# Altium schematic sheet [02]-STM32F373BluePill.SchDoc (part 3 of 4)
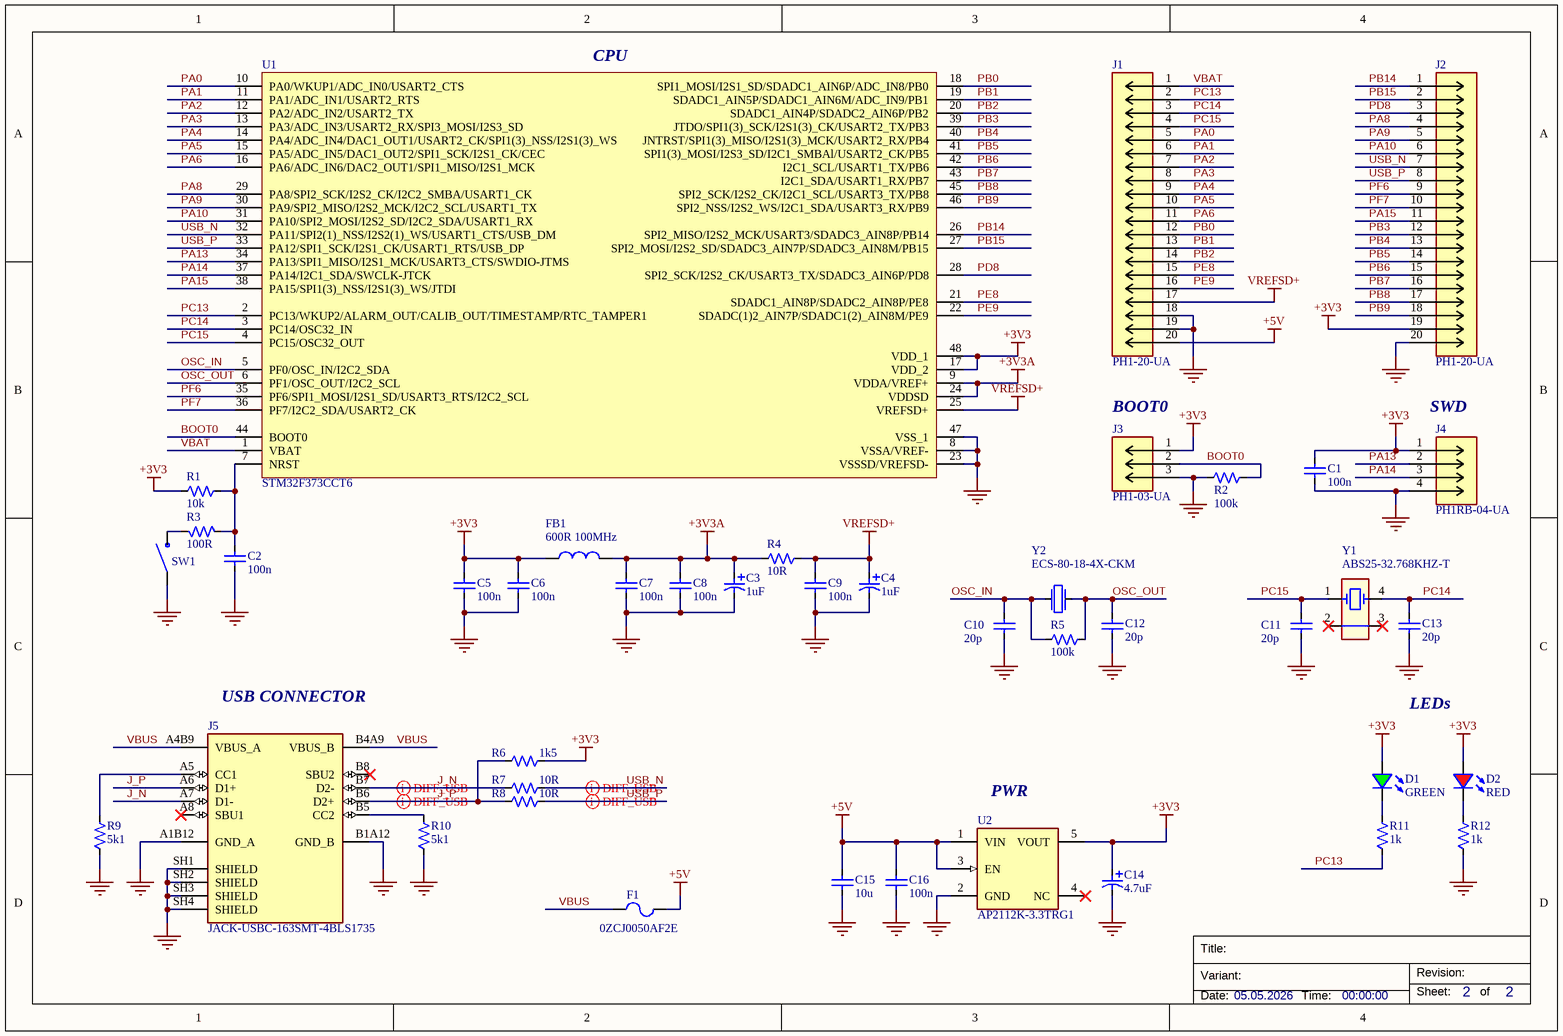
[diagram p2: [02]-STM32F373BluePill.SchDoc]

## Library data of the parts (continued)
R1 = RESC_AC0603FR-0710KL: 10 kOhms ±1% 0.1W, 1/10W Chip Resistor 0603 (1608 Metric) Automotive AEC-Q200, Moisture Resistant Thick Film; Manufacturer 1: Yageo Group; Max Power Dissipation: 100mW; Resistance: 10kΩ; Temperature Coefficient: 100ppm/°C; Voltage Rating: 75V; Tolerance: 1%; Manufacturer Part Number 1: AC0603FR-0710KL; Case/Package: 0603; Supplier 1: DigiKey; Stock 1: 0; Pricing 1: 1=0.1, 10=0.028, 25=0.0204, 50=0.0164, 100=0.0134, 250=0.01036, 500=0.00868, 1000=0.00735 (USD); RoHS: Compliant; Case Code (Imperial): 0603; Case Code (Metric): 1608; China RoHS: Non-Compliant; Composition: Thick Film; Depth: 800µm; Features: Anti-Sulfur, Automotive AEC-Q200, Moisture Resistant; Height: 450µm; Lead Free: Lead Free; Length: 1.6mm; Lifecycle Status: Production; Max Operating Temperature: 155°C; Military Standard: Not; Min Operating Temperature: -55°C; Mount: Surface Mount; Number of Terminals: 2; Number of Terminations: 2; Power Rating: 100mW; Ratings: AEC-Q200; REACH SVHC: Yes; Schedule B: 8533210045, 8533210045|8533210045|8533210045|8533210045|8533210045|8533210045|8533210045|8533210045|8533210045|8533210045|8533210045|8533210045|8533210045|8533210045|8533210045|8533210045|8533210045|8533210045|8533210045|8533210045|8533210045|8533210045|8533210045|85; Termination: SMD/SMT; Width: 800µm; Working Voltage: 75V; ComponentLink1URL: https://datasheet.octopart.com:443/AC0603FR-0710KL-Yageo-datasheet-182189377.pdf?src-supplier=IHS; ComponentLink1Description: https://datasheet.octopart.com:443/AC0603FR-0710KL-Yageo-datasheet-182189377.pdf?src-supplier=IHS; ComponentLink2URL: https://datasheet.octopart.com:443/AC0603FR-0710KL-Yageo-datasheet-86786639.pdf?src-supplier=Upverter; ComponentLink2Description: https://datasheet.octopart.com:443/AC0603FR-0710KL-Yageo-datasheet-86786639.pdf?src-supplier=Upverter; ComponentLink3URL: https://datasheet.octopart.com:443/AC0603FR-0710KL-Yageo-datasheet-178509465.pdf?src-supplier=Newark; ComponentLink3Description: https://datasheet.octopart.com:443/AC0603FR-0710KL-Yageo-datasheet-178509465.pdf?src-supplier=Newark; ComponentLink4URL: https://datasheet.octopart.com:443/AC0603FR-0710KL-Yageo-datasheet-151884373.pdf?src-supplier=Future+Electronics; ComponentLink4Description: https://datasheet.octopart.com:443/AC0603FR-0710KL-Yageo-datasheet-151884373.pdf?src-supplier=Future+Electronics; ComponentLink5URL: https://datasheet.octopart.com:443/AC0603FR-0710KL-Yageo-Group-datasheet-189830439.pdf?src-supplier=Future+Electronics; ComponentLink5Description: https://datasheet.octopart.com:443/AC0603FR-0710KL-Yageo-Group-datasheet-189830439.pdf?src-supplier=Future+Electronics; ComponentLink6URL: https://datasheet.octopart.com:443/AC0603FR-0710KL-Yageo-datasheet-166720450.pdf?src-supplier=Future+Electronics; ComponentLink6Description: https://datasheet.octopart.com:443/AC0603FR-0710KL-Yageo-datasheet-166720450.pdf?src-supplier=Future+Electronics; ComponentLink7URL: https://datasheet.octopart.com:443/AC0603FR-0710KL-Yageo-datasheet-137699919.pdf?src-supplier=Future+Electronics; ComponentLink7Description: https://datasheet.octopart.com:443/AC0603FR-0710KL-Yageo-datasheet-137699919.pdf?src-supplier=Future+Electronics; ComponentLink8URL: https://datasheet.octopart.com:443/AC0603FR-0710KL-Yageo-datasheet-24580492.pdf?src-supplier=Future+Electronics; ComponentLink8Description: https://datasheet.octopart.com:443/AC0603FR-0710KL-Yageo-datasheet-24580492.pdf?src-supplier=Future+Electronics; ComponentLink9URL: https://datasheet.octopart.com:443/AC0603FR-0710KL-Yageo-datasheet-13029202.pdf?src-supplier=Future+Electronics; ComponentLink9Description: https://datasheet.octopart.com:443/AC0603FR-0710KL-Yageo-datasheet-13029202.pdf?src-supplier=Future+Electronics; ComponentLink10URL: https://datasheet.octopart.com/AC0603FR-0710KL-Yageo-datasheet-12512238.pdf; ComponentLink10Description: https://datasheet.octopart.com/AC0603FR-0710KL-Yageo-datasheet-12512238.pdf; ComponentLink11URL: https://datasheet.octopart.com:443/AC0603FR-0710KL-Yageo-Group-datasheet-164768995.pdf?src-supplier=ODG+(Origin+Data+Global); ComponentLink11Description: https://datasheet.octopart.com:443/AC0603FR-0710KL-Yageo-Group-datasheet-164768995.pdf?src-supplier=ODG+(Origin+Data+Global); ComponentLink12URL: http://sigma.octopart.com:80/conflict_mineral_statement/Yageo-company-3.pdf?src-supplier=Compliance+Statements; ComponentLink12Description: http://sigma.octopart.com:80/conflict_mineral_statement/Yageo-company-3.pdf?src-supplier=Compliance+Statements; ComponentLink13URL: http://sigma.octopart.com:80/rohs_statement/Yageo-company-2.pdf?src-supplier=Compliance+Statements; ComponentLink13Description: http://sigma.octopart.com:80/rohs_statement/Yageo-company-2.pdf?src-supplier=Compliance+Statements; Supplier Part Number 1: 311-10KLDCT-ND
R2 R5 = RESC_RC0603DR-07100KL: 100 kOhms ±0.5% 0.1W, 1/10W Chip Resistor 0603 (1608 Metric) Moisture Resistant Thick Film; Manufacturer 1: Yageo Group; Max Power Dissipation: 100mW; Resistance: 100kΩ; Temperature Coefficient: 100ppm/°C; Working Voltage: 75V; Tolerance: 0.5%; Supplier 1: DigiKey; Manufacturer Part Number 1: RC0603DR-07100KL; Stock 1: 43341; Pricing 1: 1=0.1, 10=0.043, 25=0.032, 50=0.0264, 100=0.0219, 250=0.0174, 500=0.01486, 1000=0.01285 (USD); RoHS: Compliant; Case/Package: 0603; China RoHS: Non-Compliant; Composition: Thick Film; Country of Origin: Mainland China, Taiwan; Export Control Classification Number (ECCN) Code: EAR99; Features: Moisture Resistant; Height: 450µm; Harmonized Tariff Schedule (HTS) Code: 8533.21.00.30; Introduction Date: 2012-06-29; Length: 1.6mm; Lifecycle Status: Production; Max Operating Temperature: 155°C; Min Operating Temperature: -55°C; Mount: Surface Mount; Number of Terminals: 2; Number of Terminations: 2; Power Rating: 100mW; REACH SVHC: Yes; Schedule B: 8533210045, 8533210045|8533210045|8533210045|8533210045|8533210045; Width: 800µm; ComponentLink1URL: https://datasheet.octopart.com:443/RC0603DR-07100KL-Yageo-datasheet-175887523.pdf?src-supplier=Newark; ComponentLink1Description: https://datasheet.octopart.com:443/RC0603DR-07100KL-Yageo-datasheet-175887523.pdf?src-supplier=Newark; ComponentLink2URL: https://datasheet.octopart.com:443/RC0603DR-07100KL-Yageo-Group-datasheet-176638170.pdf?src-supplier=Future+Electronics; ComponentLink2Description: https://datasheet.octopart.com:443/RC0603DR-07100KL-Yageo-Group-datasheet-176638170.pdf?src-supplier=Future+Electronics; ComponentLink3URL: https://datasheet.octopart.com:443/RC0603DR-07100KL-Yageo-datasheet-164759695.pdf?src-supplier=Future+Electronics; ComponentLink3Description: https://datasheet.octopart.com:443/RC0603DR-07100KL-Yageo-datasheet-164759695.pdf?src-supplier=Future+Electronics; ComponentLink4URL: https://datasheet.octopart.com:443/RC0603DR-07100KL-Yageo-datasheet-127823281.pdf?src-supplier=Future+Electronics; ComponentLink4Description: https://datasheet.octopart.com:443/RC0603DR-07100KL-Yageo-datasheet-127823281.pdf?src-supplier=Future+Electronics; ComponentLink5URL: https://datasheet.octopart.com:443/RC0603DR-07100KL-Yageo-datasheet-137700087.pdf?src-supplier=Future+Electronics; ComponentLink5Description: https://datasheet.octopart.com:443/RC0603DR-07100KL-Yageo-datasheet-137700087.pdf?src-supplier=Future+Electronics; ComponentLink6URL: https://datasheet.octopart.com:443/RC0603DR-07100KL-Yageo-datasheet-103092701.pdf?src-supplier=Future+Electronics; ComponentLink6Description: https://datasheet.octopart.com:443/RC0603DR-07100KL-Yageo-datasheet-103092701.pdf?src-supplier=Future+Electronics; ComponentLink7URL: https://datasheet.octopart.com/RC0603DR-07100KL-Yageo-datasheet-73766026.pdf; ComponentLink7Description: https://datasheet.octopart.com/RC0603DR-07100KL-Yageo-datasheet-73766026.pdf; ComponentLink8URL: http://sigma.octopart.com:80/conflict_mineral_statement/Yageo-company-3.pdf?src-supplier=Compliance+Statements; ComponentLink8Description: http://sigma.octopart.com:80/conflict_mineral_statement/Yageo-company-3.pdf?src-supplier=Compliance+Statements; ComponentLink9URL: http://sigma.octopart.com:80/rohs_statement/Yageo-company-2.pdf?src-supplier=Compliance+Statements; ComponentLink9Description: http://sigma.octopart.com:80/rohs_statement/Yageo-company-2.pdf?src-supplier=Compliance+Statements; Supplier Part Number 1: 13-RC0603DR-07100KLDKR-ND
R3 = RESC_RC0603FR-10100RL: 100 Ohms ±1% 0.1W, 1/10W Chip Resistor 0603 (1608 Metric) Moisture Resistant Thick Film; Manufacturer 1: Yageo Group; Power Rating: 100mW; Resistance: 100Ω; Temperature Coefficient: 100ppm/°C; Voltage Rating: 50V; Working Voltage: 75V; Supplier 1: DigiKey; Manufacturer Part Number 1: RC0603FR-10100RL; Stock 1: 209381; Pricing 1: 1=0.1, 10=0.024, 25=0.0172, 50=0.0138, 100=0.0112, 250=0.0086, 500=0.00716, 1000=0.00603, 5000=0.00424 (USD); RoHS: Compliant; Case/Package: 0603; Case Code (Imperial): 0603; Case Code (Metric): 1608; China RoHS: Non-Compliant; Composition: Thick Film; Contact Plating: Lead, Tin; Depth: 800µm; Height: 450µm; Lead Free: Lead Free; Length: 1.6mm; Lifecycle Status: Production; Max Operating Temperature: 155°C; Military Standard: Not; Min Operating Temperature: -55°C; Mount: Surface Mount; Number of Pins: 2; Number of Terminals: 2; Radiation Hardening: No; REACH SVHC: Yes; Schedule B: 8533210045, 8533210045|8533210045, 8533210045|8533210045|8533210045, 8533210045|8533210045|8533210045|8533210045; Termination: SMD/SMT; Tolerance: 1%; Voltage Rating (DC): 50V; Width: 800µm; ComponentLink1URL: https://datasheet.octopart.com:443/RC0603FR-10100RL-Yageo-datasheet-175887523.pdf?src-supplier=IHS; ComponentLink1Description: https://datasheet.octopart.com:443/RC0603FR-10100RL-Yageo-datasheet-175887523.pdf?src-supplier=IHS; ComponentLink2URL: https://datasheet.octopart.com:443/RC0603FR-10100RL-Yageo-Group-datasheet-190305687.pdf?src-supplier=Future+Electronics; ComponentLink2Description: https://datasheet.octopart.com:443/RC0603FR-10100RL-Yageo-Group-datasheet-190305687.pdf?src-supplier=Future+Electronics; ComponentLink3URL: https://datasheet.octopart.com:443/RC0603FR-10100RL-Yageo-datasheet-164759695.pdf?src-supplier=Future+Electronics; ComponentLink3Description: https://datasheet.octopart.com:443/RC0603FR-10100RL-Yageo-datasheet-164759695.pdf?src-supplier=Future+Electronics; ComponentLink4URL: https://datasheet.octopart.com:443/RC0603FR-10100RL-Yageo-datasheet-137700087.pdf?src-supplier=Future+Electronics; ComponentLink4Description: https://datasheet.octopart.com:443/RC0603FR-10100RL-Yageo-datasheet-137700087.pdf?src-supplier=Future+Electronics; ComponentLink5URL: https://datasheet.octopart.com:443/RC0603FR-10100RL-Yageo-datasheet-27584510.pdf?src-supplier=Future+Electronics; ComponentLink5Description: https://datasheet.octopart.com:443/RC0603FR-10100RL-Yageo-datasheet-27584510.pdf?src-supplier=Future+Electronics; ComponentLink6URL: https://datasheet.octopart.com:443/RC0603FR-10100RL-Yageo-datasheet-17842380.pdf?src-supplier=Future+Electronics; ComponentLink6Description: https://datasheet.octopart.com:443/RC0603FR-10100RL-Yageo-datasheet-17842380.pdf?src-supplier=Future+Electronics; ComponentLink7URL: https://datasheet.octopart.com:443/RC0603FR-10100RL-Yageo-datasheet-12596169.pdf?src-supplier=Future+Electronics; ComponentLink7Description: https://datasheet.octopart.com:443/RC0603FR-10100RL-Yageo-datasheet-12596169.pdf?src-supplier=Future+Electronics; ComponentLink8URL: https://datasheet.octopart.com:443/RC0603FR-10100RL-Yageo-Group-datasheet-190051977.pdf?src-supplier=Newark; ComponentLink8Description: https://datasheet.octopart.com:443/RC0603FR-10100RL-Yageo-Group-datasheet-190051977.pdf?src-supplier=Newark; ComponentLink9URL: https://datasheet.octopart.com:443/RC0603FR-10100RL-Yageo-Group-datasheet-189192902.pdf?src-supplier=TME; ComponentLink9Description: https://datasheet.octopart.com:443/RC0603FR-10100RL-Yageo-Group-datasheet-189192902.pdf?src-supplier=TME; ComponentLink10URL: https://datasheet.octopart.com:443/RC0603FR-10100RL-Yageo-Group-datasheet-176638170.pdf?src-supplier=TME; ComponentLink10Description: https://datasheet.octopart.com:443/RC0603FR-10100RL-Yageo-Group-datasheet-176638170.pdf?src-supplier=TME; ComponentLink11URL: https://datasheet.octopart.com:443/RC0603FR-10100RL-Yageo-datasheet-8328172.pdf?src-supplier=element14+APAC; ComponentLink11Description: https://datasheet.octopart.com:443/RC0603FR-10100RL-Yageo-datasheet-8328172.pdf?src-supplier=element14+APAC; ComponentLink12URL: https://datasheet.octopart.com:443/RC0603FR-10100RL-Yageo-datasheet-34211833.pdf?src-supplier=element14+APAC; ComponentLink12Description: https://datasheet.octopart.com:443/RC0603FR-10100RL-Yageo-datasheet-34211833.pdf?src-supplier=element14+APAC; ComponentLink13URL: https://datasheet.octopart.com/RC0603FR-10100RL-Yageo-datasheet-73766026.pdf; ComponentLink13Description: https://datasheet.octopart.com/RC0603FR-10100RL-Yageo-datasheet-73766026.pdf; ComponentLink14URL: http://sigma.octopart.com:80/conflict_mineral_statement/Yageo-company-3.pdf?src-supplier=Compliance+Statements; ComponentLink14Description: http://sigma.octopart.com:80/conflict_mineral_statement/Yageo-company-3.pdf?src-supplier=Compliance+Statements; Supplier Part Number 1: 13-RC0603FR-10100RLCT-ND; ComponentLink15URL: http://sigma.octopart.com:80/rohs_statement/Yageo-company-2.pdf?src-supplier=Compliance+Statements; ComponentLink15Description: http://sigma.octopart.com:80/rohs_statement/Yageo-company-2.pdf?src-supplier=Compliance+Statements
R4 R7 R8 = RESC_RC0603FR-0710RL: Res Thick Film 0603 10 Ohm 1% 0.1W(1/10W) ±200ppm/C Pad SMD T/R; Manufacturer 1: Yageo Group; Power Dissipation: 100mW; Resistance: 10Ω; Temperature Coefficient: 200ppm/°C; Voltage Rating: 50V; Working Voltage: 75V; Supplier 1: DigiKey; Manufacturer Part Number 1: RC0603FR-0710RL; Stock 1: 1408775; Pricing 1: 1=0,14, 10=0,013, 25=0,0124, 50=0,0112, 100=0,0092 (USD); RoHS: Compliant; Case/Package: 0603; Case Code (Imperial): 0603; Case Code (Metric): 0603; China RoHS: Non-Compliant; Composition: Thick Film; Contact Plating: Tin; Depth: 800µm; Height: 450µm; Lead Free: Lead Free; Length: 1.6mm; Lifecycle Status: Production; Max Operating Temperature: 155°C; Military Standard: Not; Min Operating Temperature: -55°C; Mount: Surface Mount; Number of Pins: 2; Number of Terminals: 2; Packaging: Tape and Reel; Power Rating: 100mW; Radiation Hardening: No; REACH SVHC: Yes; Schedule B: 8533210045, 8533210045|8533210045|8533210045|8533210045|8533210045|8533210045|8533210045|8533210045|8533210045|8533210045|8533210045|8533210045|8533210045|8533210045|8533210045|8533210045|8533210045|8533210045|8533210045|8533210045|8533210045|8533210045|8533210045|85; Termination: SMD/SMT; Tolerance: 1%; Voltage Rating (AC): 50V; Voltage Rating (DC): 50V; Width: 800µm; ComponentLink1URL: https://datasheet.octopart.com:443/RC0603FR-0710RL-Yageo-datasheet-175887523.pdf?src-supplier=IHS; ComponentLink1Description: https://datasheet.octopart.com:443/RC0603FR-0710RL-Yageo-datasheet-175887523.pdf?src-supplier=IHS; ComponentLink2URL: https://datasheet.octopart.com:443/RC0603FR-0710RL-Yageo-datasheet-62067350.pdf?src-supplier=Farnell; ComponentLink2Description: https://datasheet.octopart.com:443/RC0603FR-0710RL-Yageo-datasheet-62067350.pdf?src-supplier=Farnell; ComponentLink3URL: https://datasheet.octopart.com:443/RC0603FR-0710RL-Yageo-Group-datasheet-176638170.pdf?src-supplier=Farnell; ComponentLink3Description: https://datasheet.octopart.com:443/RC0603FR-0710RL-Yageo-Group-datasheet-176638170.pdf?src-supplier=Farnell; ComponentLink4URL: https://datasheet.octopart.com:443/RC0603FR-0710RL-Yageo-datasheet-13691069.pdf?src-supplier=Farnell; ComponentLink4Description: https://datasheet.octopart.com:443/RC0603FR-0710RL-Yageo-datasheet-13691069.pdf?src-supplier=Farnell; ComponentLink5URL: https://datasheet.octopart.com:443/RC0603FR-0710RL-Yageo-datasheet-103092701.pdf?src-supplier=Upverter; ComponentLink5Description: https://datasheet.octopart.com:443/RC0603FR-0710RL-Yageo-datasheet-103092701.pdf?src-supplier=Upverter; ComponentLink6URL: https://datasheet.octopart.com:443/RC0603FR-0710RL-Yageo-datasheet-98239111.pdf?src-supplier=Upverter; ComponentLink6Description: https://datasheet.octopart.com:443/RC0603FR-0710RL-Yageo-datasheet-98239111.pdf?src-supplier=Upverter; ComponentLink7URL: https://datasheet.octopart.com:443/RC0603FR-0710RL-Yageo-datasheet-79472498.pdf?src-supplier=Upverter; ComponentLink7Description: https://datasheet.octopart.com:443/RC0603FR-0710RL-Yageo-datasheet-79472498.pdf?src-supplier=Upverter; ComponentLink8URL: https://datasheet.octopart.com:443/RC0603FR-0710RL-Yageo-datasheet-8328172.pdf?src-supplier=element14+APAC; ComponentLink8Description: https://datasheet.octopart.com:443/RC0603FR-0710RL-Yageo-datasheet-8328172.pdf?src-supplier=element14+APAC; ComponentLink9URL: https://datasheet.octopart.com:443/RC0603FR-0710RL-Yageo-datasheet-164759695.pdf?src-supplier=Future+Electronics; ComponentLink9Description: https://datasheet.octopart.com:443/RC0603FR-0710RL-Yageo-datasheet-164759695.pdf?src-supplier=Future+Electronics; ComponentLink10URL: https://datasheet.octopart.com:443/RC0603FR-0710RL-Yageo-datasheet-137700087.pdf?src-supplier=Future+Electronics; ComponentLink10Description: https://datasheet.octopart.com:443/RC0603FR-0710RL-Yageo-datasheet-137700087.pdf?src-supplier=Future+Electronics; ComponentLink11URL: https://datasheet.octopart.com:443/RC0603FR-0710RL-Yageo-datasheet-27584510.pdf?src-supplier=Future+Electronics; ComponentLink11Description: https://datasheet.octopart.com:443/RC0603FR-0710RL-Yageo-datasheet-27584510.pdf?src-supplier=Future+Electronics; ComponentLink12URL: https://datasheet.octopart.com:443/RC0603FR-0710RL-Yageo-datasheet-15599030.pdf?src-supplier=Future+Electronics; ComponentLink12Description: https://datasheet.octopart.com:443/RC0603FR-0710RL-Yageo-datasheet-15599030.pdf?src-supplier=Future+Electronics; ComponentLink13URL: https://datasheet.octopart.com:443/RC0603FR-0710RL-Yageo-datasheet-12596169.pdf?src-supplier=Future+Electronics; ComponentLink13Description: https://datasheet.octopart.com:443/RC0603FR-0710RL-Yageo-datasheet-12596169.pdf?src-supplier=Future+Electronics; ComponentLink14URL: https://datasheet.octopart.com:443/RC0603FR-0710RL-Yageo-datasheet-8324193.pdf?src-supplier=Future+Electronics; ComponentLink14Description: https://datasheet.octopart.com:443/RC0603FR-0710RL-Yageo-datasheet-8324193.pdf?src-supplier=Future+Electronics; ComponentLink15URL: https://datasheet.octopart.com:443/RC0603FR-0710RL-Yageo-datasheet-34211833.pdf?src-supplier=Newark; ComponentLink15Description: https://datasheet.octopart.com:443/RC0603FR-0710RL-Yageo-datasheet-34211833.pdf?src-supplier=Newark; ComponentLink16URL: https://datasheet.octopart.com/RC0603FR-0710RL-Yageo-datasheet-73766026.pdf; ComponentLink16Description: https://datasheet.octopart.com/RC0603FR-0710RL-Yageo-datasheet-73766026.pdf; ComponentLink17URL: https://datasheet.octopart.com:443/RC0603FR-0710RL-Yageo-datasheet-30459151.pdf?src-supplier=Seeed+Studio; ComponentLink17Description: https://datasheet.octopart.com:443/RC0603FR-0710RL-Yageo-datasheet-30459151.pdf?src-supplier=Seeed+Studio; ComponentLink18URL: https://datasheet.octopart.com:443/RC0603FR-0710RL-Yageo-datasheet-14181472.pdf?src-supplier=iiiC; ComponentLink18Description: https://datasheet.octopart.com:443/RC0603FR-0710RL-Yageo-datasheet-14181472.pdf?src-supplier=iiiC; ComponentLink19URL: https://datasheet.octopart.com:443/RC0603FR-0710RL-Yageo-datasheet-118562.pdf?src-supplier=DigiKey; ComponentLink19Description: https://datasheet.octopart.com:443/RC0603FR-0710RL-Yageo-datasheet-118562.pdf?src-supplier=DigiKey; ComponentLink20URL: http://sigma.octopart.com:80/conflict_mineral_statement/Yageo-company-3.pdf?src-supplier=Compliance+Statements; ComponentLink20Description: http://sigma.octopart.com:80/conflict_mineral_statement/Yageo-company-3.pdf?src-supplier=Compliance+Statements; ComponentLink21URL: http://sigma.octopart.com:80/rohs_statement/Yageo-company-2.pdf?src-supplier=Compliance+Statements; ComponentLink21Description: http://sigma.octopart.com:80/rohs_statement/Yageo-company-2.pdf?src-supplier=Compliance+Statements; Supplier Part Number 1: 311-10.0HRCT-ND
R6 = RESC_AC0603FR-071K5L: 1.5 kOhms ±1% 0.1W, 1/10W Chip Resistor 0603 (1608 Metric) Automotive AEC-Q200, Moisture Resistant Thick Film; Manufacturer 1: Yageo Group; Max Power Dissipation: 100mW; Resistance: 1.5kΩ; Temperature Coefficient: 100ppm/°C; Voltage Rating: 75V; Supplier 1: DigiKey; Manufacturer Part Number 1: AC0603FR-071K5L; Stock 1: 23378; Pricing 1: 1=0,1, 10=0,009, 25=0,008, 50=0,0072, 100=0,0069 (USD); RoHS: Compliant; Case/Package: 0603; Case Code (Imperial): 0603; Case Code (Metric): 1608; China RoHS: Non-Compliant; Composition: Thick Film; Features: Anti-Sulfur, Automotive AEC-Q200, Moisture Resistant; Height: 450µm; Lead Free: Lead Free; Length: 1.6002mm; Lifecycle Status: Production; Max Operating Temperature: 155°C; Min Operating Temperature: -55°C; Mount: Surface Mount; Number of Terminals: 2; Number of Terminations: 2; Packaging: Tape & Reel; Power Dissipation: 100mW; Power Rating: 100mW; REACH SVHC: Yes; Schedule B: 8533210045, 8533210045|8533210045, 8533210045|8533210045|8533210045, 8533210045|8533210045|8533210045|8533210045; Termination: SMD/SMT; Tolerance: 1%; Width: 800µm; Working Voltage: 75V; ComponentLink1URL: https://datasheet.octopart.com:443/AC0603FR-071K5L-Yageo-datasheet-182189377.pdf?src-supplier=IHS; ComponentLink1Description: https://datasheet.octopart.com:443/AC0603FR-071K5L-Yageo-datasheet-182189377.pdf?src-supplier=IHS; ComponentLink2URL: https://datasheet.octopart.com:443/AC0603FR-071K5L-Yageo-datasheet-86786639.pdf?src-supplier=Upverter; ComponentLink2Description: https://datasheet.octopart.com:443/AC0603FR-071K5L-Yageo-datasheet-86786639.pdf?src-supplier=Upverter; ComponentLink3URL: https://datasheet.octopart.com:443/AC0603FR-071K5L-Yageo-datasheet-178509465.pdf?src-supplier=Newark; ComponentLink3Description: https://datasheet.octopart.com:443/AC0603FR-071K5L-Yageo-datasheet-178509465.pdf?src-supplier=Newark; ComponentLink4URL: https://datasheet.octopart.com:443/AC0603FR-071K5L-Yageo-Group-datasheet-188689268.pdf?src-supplier=TME; ComponentLink4Description: https://datasheet.octopart.com:443/AC0603FR-071K5L-Yageo-Group-datasheet-188689268.pdf?src-supplier=TME; ComponentLink5URL: https://datasheet.octopart.com:443/AC0603FR-071K5L-Yageo-datasheet-166720450.pdf?src-supplier=Future+Electronics; ComponentLink5Description: https://datasheet.octopart.com:443/AC0603FR-071K5L-Yageo-datasheet-166720450.pdf?src-supplier=Future+Electronics; ComponentLink6URL: https://datasheet.octopart.com:443/AC0603FR-071K5L-Yageo-datasheet-151884373.pdf?src-supplier=Future+Electronics; ComponentLink6Description: https://datasheet.octopart.com:443/AC0603FR-071K5L-Yageo-datasheet-151884373.pdf?src-supplier=Future+Electronics; ComponentLink7URL: https://datasheet.octopart.com:443/AC0603FR-071K5L-Yageo-datasheet-137699919.pdf?src-supplier=Future+Electronics; ComponentLink7Description: https://datasheet.octopart.com:443/AC0603FR-071K5L-Yageo-datasheet-137699919.pdf?src-supplier=Future+Electronics; ComponentLink8URL: https://datasheet.octopart.com:443/AC0603FR-071K5L-Yageo-datasheet-83209224.pdf?src-supplier=Future+Electronics; ComponentLink8Description: https://datasheet.octopart.com:443/AC0603FR-071K5L-Yageo-datasheet-83209224.pdf?src-supplier=Future+Electronics; ComponentLink9URL: https://datasheet.octopart.com:443/AC0603FR-071K5L-Yageo-Group-datasheet-164768995.pdf?src-supplier=ODG+(Origin+Data+Global); ComponentLink9Description: https://datasheet.octopart.com:443/AC0603FR-071K5L-Yageo-Group-datasheet-164768995.pdf?src-supplier=ODG+(Origin+Data+Global); ComponentLink10URL: https://datasheet.octopart.com:443/AC0603FR-071K5L-Yageo-datasheet-128678910.pdf?src-supplier=X-ON; ComponentLink10Description: https://datasheet.octopart.com:443/AC0603FR-071K5L-Yageo-datasheet-128678910.pdf?src-supplier=X-ON; ComponentLink11URL: https://datasheet.octopart.com/AC0603FR-071K5L-Yageo-datasheet-12512238.pdf; ComponentLink11Description: https://datasheet.octopart.com/AC0603FR-071K5L-Yageo-datasheet-12512238.pdf; ComponentLink12URL: http://sigma.octopart.com:80/conflict_mineral_statement/Yageo-company-3.pdf?src-supplier=Compliance+Statements; ComponentLink12Description: http://sigma.octopart.com:80/conflict_mineral_statement/Yageo-company-3.pdf?src-supplier=Compliance+Statements; ComponentLink13URL: http://sigma.octopart.com:80/rohs_statement/Yageo-company-2.pdf?src-supplier=Compliance+Statements; ComponentLink13Description: http://sigma.octopart.com:80/rohs_statement/Yageo-company-2.pdf?src-supplier=Compliance+Statements; Supplier Part Number 1: 311-1.5KLDCT-ND
R9 R10 = RESC_RC0603FR-075K1L: 5.1 kOhms ±1% 0.1W, 1/10W Chip Resistor 0603 (1608 Metric) Moisture Resistant Thick Film; Manufacturer 1: Yageo Group; Max Power Dissipation: 100mW; Resistance: 5.1kΩ; Temperature Coefficient: 100ppm/°C; Voltage Rating: 75V; Voltage Rating (DC): 50V; Supplier 1: DigiKey; Manufacturer Part Number 1: RC0603FR-075K1L; Stock 1: 606509; Pricing 1: 1=0,1, 10=0,007, 25=0,0068, 50=0,0062, 100=0,0057 (USD); RoHS: Compliant; Case/Package: 0603; Case Code (Imperial): 0603; China RoHS: Non-Compliant; Composition: Thick Film; Depth: 800µm; Features: Moisture Resistant; Height: 450µm; Lead Free: Lead Free; Lifecycle Status: Production; Max Operating Temperature: 155°C; Military Standard: Not; Min Operating Temperature: -55°C; Mount: Surface Mount; Number of Pins: 2; Number of Terminals: 2; Number of Terminations: 2; Packaging: Tape & Reel; Power Dissipation: 100mW; Power Rating: 100mW; REACH SVHC: Yes; Schedule B: 8533210045, 8533210045|8533210045, 8533210045|8533210045|8533210045, 8533210045|8533210045|8533210045|8533210045; Termination: SMD/SMT; Tolerance: 1%; Width: 800µm; Working Voltage: 75V; ComponentLink1URL: https://datasheet.octopart.com:443/RC0603FR-075K1L-Yageo-datasheet-175887523.pdf?src-supplier=IHS; ComponentLink1Description: https://datasheet.octopart.com:443/RC0603FR-075K1L-Yageo-datasheet-175887523.pdf?src-supplier=IHS; ComponentLink2URL: https://datasheet.octopart.com:443/RC0603FR-075K1L-Yageo-datasheet-103092701.pdf?src-supplier=Upverter; ComponentLink2Description: https://datasheet.octopart.com:443/RC0603FR-075K1L-Yageo-datasheet-103092701.pdf?src-supplier=Upverter; ComponentLink3URL: https://datasheet.octopart.com:443/RC0603FR-075K1L-Yageo-Group-datasheet-190305687.pdf?src-supplier=Newark; ComponentLink3Description: https://datasheet.octopart.com:443/RC0603FR-075K1L-Yageo-Group-datasheet-190305687.pdf?src-supplier=Newark; ComponentLink4URL: https://datasheet.octopart.com:443/RC0603FR-075K1L-Yageo-datasheet-8328172.pdf?src-supplier=Farnell; ComponentLink4Description: https://datasheet.octopart.com:443/RC0603FR-075K1L-Yageo-datasheet-8328172.pdf?src-supplier=Farnell; ComponentLink5URL: https://datasheet.octopart.com:443/RC0603FR-075K1L-Yageo-datasheet-62067350.pdf?src-supplier=Farnell; ComponentLink5Description: https://datasheet.octopart.com:443/RC0603FR-075K1L-Yageo-datasheet-62067350.pdf?src-supplier=Farnell; ComponentLink6URL: https://datasheet.octopart.com:443/RC0603FR-075K1L-Yageo-datasheet-34211833.pdf?src-supplier=element14+APAC; ComponentLink6Description: https://datasheet.octopart.com:443/RC0603FR-075K1L-Yageo-datasheet-34211833.pdf?src-supplier=element14+APAC; ComponentLink7URL: https://datasheet.octopart.com:443/RC0603FR-075K1L-Yageo-datasheet-164759695.pdf?src-supplier=Future+Electronics; ComponentLink7Description: https://datasheet.octopart.com:443/RC0603FR-075K1L-Yageo-datasheet-164759695.pdf?src-supplier=Future+Electronics; ComponentLink8URL: https://datasheet.octopart.com:443/RC0603FR-075K1L-Yageo-datasheet-137700087.pdf?src-supplier=Future+Electronics; ComponentLink8Description: https://datasheet.octopart.com:443/RC0603FR-075K1L-Yageo-datasheet-137700087.pdf?src-supplier=Future+Electronics; ComponentLink9URL: https://datasheet.octopart.com:443/RC0603FR-075K1L-Yageo-datasheet-15599030.pdf?src-supplier=Future+Electronics; ComponentLink9Description: https://datasheet.octopart.com:443/RC0603FR-075K1L-Yageo-datasheet-15599030.pdf?src-supplier=Future+Electronics; ComponentLink10URL: https://datasheet.octopart.com:443/RC0603FR-075K1L-Yageo-datasheet-12596169.pdf?src-supplier=Future+Electronics; ComponentLink10Description: https://datasheet.octopart.com:443/RC0603FR-075K1L-Yageo-datasheet-12596169.pdf?src-supplier=Future+Electronics; ComponentLink11URL: https://datasheet.octopart.com:443/RC0603FR-075K1L-Yageo-datasheet-503470.pdf?src-supplier=Future+Electronics; ComponentLink11Description: https://datasheet.octopart.com:443/RC0603FR-075K1L-Yageo-datasheet-503470.pdf?src-supplier=Future+Electronics; ComponentLink12URL: https://datasheet.octopart.com:443/RC0603FR-075K1L-Yageo-datasheet-148775077.pdf?src-supplier=TME; ComponentLink12Description: https://datasheet.octopart.com:443/RC0603FR-075K1L-Yageo-datasheet-148775077.pdf?src-supplier=TME; ComponentLink13URL: https://datasheet.octopart.com:443/RC0603FR-075K1L-Yageo-datasheet-79472498.pdf?src-supplier=Megastar; ComponentLink13Description: https://datasheet.octopart.com:443/RC0603FR-075K1L-Yageo-datasheet-79472498.pdf?src-supplier=Megastar; ComponentLink14URL: https://datasheet.octopart.com/RC0603FR-075K1L-Yageo-datasheet-73766026.pdf; ComponentLink14Description: https://datasheet.octopart.com/RC0603FR-075K1L-Yageo-datasheet-73766026.pdf; ComponentLink15URL: https://datasheet.octopart.com:443/RC0603FR-075K1L-Yageo-datasheet-118562.pdf?src-supplier=DigiKey; ComponentLink15Description: https://datasheet.octopart.com:443/RC0603FR-075K1L-Yageo-datasheet-118562.pdf?src-supplier=DigiKey; ComponentLink16URL: http://sigma.octopart.com:80/conflict_mineral_statement/Yageo-company-3.pdf?src-supplier=Compliance+Statements; ComponentLink16Description: http://sigma.octopart.com:80/conflict_mineral_statement/Yageo-company-3.pdf?src-supplier=Compliance+Statements; ComponentLink17URL: http://sigma.octopart.com:80/rohs_statement/Yageo-company-2.pdf?src-supplier=Compliance+Statements; ComponentLink17Description: http://sigma.octopart.com:80/rohs_statement/Yageo-company-2.pdf?src-supplier=Compliance+Statements; Supplier Part Number 1: 311-5.10KHRCT-ND
R11 R12 = RESC_RC0603FR-101KL: 1 kOhms ±1% 0.1W, 1/10W Chip Resistor 0603 (1608 Metric) Moisture Resistant Thick Film; Manufacturer 1: Yageo Group; Power Rating: 100mW; Resistance: 1kΩ; Temperature Coefficient: 100ppm/°C; Voltage Rating: 50V; Working Voltage: 75V; Supplier 1: DigiKey; Manufacturer Part Number 1: RC0603FR-101KL; Stock 1: 359273; Pricing 1: 1=0.1, 10=0.024, 25=0.0172, 50=0.0138, 100=0.0112, 250=0.0086, 500=0.00716, 1000=0.00603, 5000=0.00424 (USD); RoHS: Compliant; Case/Package: 0603; Case Code (Imperial): 0603; Case Code (Metric): 1608; China RoHS: Non-Compliant; Composition: Thick Film; Contact Plating: Lead, Tin; Depth: 800µm; Height: 450µm; Length: 1.6mm; Lifecycle Status: Production; Max Operating Temperature: 155°C; Military Standard: Not; Min Operating Temperature: -55°C; Mount: Surface Mount; Number of Pins: 2; Number of Terminals: 2; Radiation Hardening: No; REACH SVHC: Yes; Schedule B: 8533210045, 8533210045|8533210045|8533210045|8533210045|8533210045; Termination: SMD/SMT; Tolerance: 1%; Voltage Rating (DC): 50V; Width: 800µm; ComponentLink1URL: https://datasheet.octopart.com:443/RC0603FR-101KL-Yageo-datasheet-175887523.pdf?src-supplier=IHS; ComponentLink1Description: https://datasheet.octopart.com:443/RC0603FR-101KL-Yageo-datasheet-175887523.pdf?src-supplier=IHS; ComponentLink2URL: https://datasheet.octopart.com:443/RC0603FR-101KL-Yageo-Group-datasheet-190051977.pdf?src-supplier=Newark; ComponentLink2Description: https://datasheet.octopart.com:443/RC0603FR-101KL-Yageo-Group-datasheet-190051977.pdf?src-supplier=Newark; ComponentLink3URL: https://datasheet.octopart.com:443/RC0603FR-101KL-Yageo-Group-datasheet-189192902.pdf?src-supplier=TME; ComponentLink3Description: https://datasheet.octopart.com:443/RC0603FR-101KL-Yageo-Group-datasheet-189192902.pdf?src-supplier=TME; ComponentLink4URL: https://datasheet.octopart.com:443/RC0603FR-101KL-Yageo-Group-datasheet-176638170.pdf?src-supplier=Future+Electronics; ComponentLink4Description: https://datasheet.octopart.com:443/RC0603FR-101KL-Yageo-Group-datasheet-176638170.pdf?src-supplier=Future+Electronics; ComponentLink5URL: https://datasheet.octopart.com:443/RC0603FR-101KL-Yageo-datasheet-164759695.pdf?src-supplier=Future+Electronics; ComponentLink5Description: https://datasheet.octopart.com:443/RC0603FR-101KL-Yageo-datasheet-164759695.pdf?src-supplier=Future+Electronics; ComponentLink6URL: https://datasheet.octopart.com:443/RC0603FR-101KL-Yageo-datasheet-137700087.pdf?src-supplier=Future+Electronics; ComponentLink6Description: https://datasheet.octopart.com:443/RC0603FR-101KL-Yageo-datasheet-137700087.pdf?src-supplier=Future+Electronics; ComponentLink7URL: https://datasheet.octopart.com:443/RC0603FR-101KL-Yageo-datasheet-134544186.pdf?src-supplier=Future+Electronics; ComponentLink7Description: https://datasheet.octopart.com:443/RC0603FR-101KL-Yageo-datasheet-134544186.pdf?src-supplier=Future+Electronics; ComponentLink8URL: https://datasheet.octopart.com:443/RC0603FR-101KL-Yageo-datasheet-8328172.pdf?src-supplier=element14+APAC; ComponentLink8Description: https://datasheet.octopart.com:443/RC0603FR-101KL-Yageo-datasheet-8328172.pdf?src-supplier=element14+APAC; ComponentLink9URL: https://datasheet.octopart.com:443/RC0603FR-101KL-Yageo-datasheet-34211833.pdf?src-supplier=element14+APAC; ComponentLink9Description: https://datasheet.octopart.com:443/RC0603FR-101KL-Yageo-datasheet-34211833.pdf?src-supplier=element14+APAC; ComponentLink10URL: https://datasheet.octopart.com/RC0603FR-101KL-Yageo-datasheet-73766026.pdf; ComponentLink10Description: https://datasheet.octopart.com/RC0603FR-101KL-Yageo-datasheet-73766026.pdf; ComponentLink11URL: http://sigma.octopart.com:80/conflict_mineral_statement/Yageo-company-3.pdf?src-supplier=Compliance+Statements; ComponentLink11Description: http://sigma.octopart.com:80/conflict_mineral_statement/Yageo-company-3.pdf?src-supplier=Compliance+Statements; ComponentLink12URL: http://sigma.octopart.com:80/rohs_statement/Yageo-company-2.pdf?src-supplier=Compliance+Statements; ComponentLink12Description: http://sigma.octopart.com:80/rohs_statement/Yageo-company-2.pdf?src-supplier=Compliance+Statements; Supplier Part Number 1: 13-RC0603FR-101KLDKR-ND; Country of Origin: Mainland China, Taiwan; Export Control Classification Number (ECCN) Code: EAR99; Harmonized Tariff Schedule (HTS) Code: 8533.21.00.30; Introduction Date: 2008-07-18
SW1 = SW_TS09-63-25-R-260-SMT-TR: Switch Tactile OFF (ON) SPST Rectangular Button Gull Wing 0.05A 12VDC 40000Cycles 2.6N SMD T/R; Manufacturer 1: Same Sky; Contact Resistance: 100mΩ; Dielectric Material: Liquid Crystal Polymer; Electrical Life: 40kcycles; Max Current Rating: 50mA; Max Voltage Rating (DC): 12V; Number of Positions: 1; Operating Force: 3.3N; Supplier 1: DigiKey; Manufacturer Part Number 1: TS09-63-25-R-260-SMT-TR; Stock 1: 2655; Pricing 1: 1=0.26, 10=0.226, 25=0.2112, 100=0.1895, 250=0.17568, 500=0.1658, 1000=0.1565 (USD); RoHS: Compliant; Color: Black, Red; Contact Material: Stainless Steel; Contact Plating: Silver; Export Control Classification Number (ECCN) Code: EAR99; Height: 1.8mm; Housing Material: Stainless Steel; Harmonized Tariff Schedule (HTS) Code: 8536.50.90.40; Insulation Resistance: 100MΩ; Introduction Date: 2024-11-07; Length: 6.1mm; Lifecycle Status: Production; Max Operating Temperature: 80°C; Min Operating Temperature: -30°C; Schedule B: 8536509065, 8536509065|8536509065|8536509065|8536509065|8536509065; Terminal Material: Brass; Throw Configuration: SPST; ComponentLink1URL: https://datasheet.octopart.com:443/TS09-63-25-R-260-SMT-TR-Same-Sky-datasheet-188843485.pdf?src-supplier=Same+Sky; ComponentLink1Description: https://datasheet.octopart.com:443/TS09-63-25-R-260-SMT-TR-Same-Sky-datasheet-188843485.pdf?src-supplier=Same+Sky; ComponentLink2URL: https://datasheet.octopart.com:443/TS09-63-25-R-260-SMT-TR-Same-Sky-datasheet-181920478.pdf?src-supplier=Same+Sky; ComponentLink2Description: https://datasheet.octopart.com:443/TS09-63-25-R-260-SMT-TR-Same-Sky-datasheet-181920478.pdf?src-supplier=Same+Sky; ComponentLink3URL: https://datasheet.octopart.com:443/TS09-63-25-R-260-SMT-TR-Same-Sky-datasheet-181920477.pdf?src-supplier=Same+Sky; ComponentLink3Description: https://datasheet.octopart.com:443/TS09-63-25-R-260-SMT-TR-Same-Sky-datasheet-181920477.pdf?src-supplier=Same+Sky; ComponentLink4URL: https://datasheet.octopart.com:443/TS09-63-25-R-260-SMT-TR-CUI-Devices-datasheet-175929131.pdf?src-supplier=Same+Sky; ComponentLink4Description: https://datasheet.octopart.com:443/TS09-63-25-R-260-SMT-TR-CUI-Devices-datasheet-175929131.pdf?src-supplier=Same+Sky; ComponentLink5URL: https://datasheet.octopart.com:443/TS09-63-25-R-260-SMT-TR-CUI-Devices-datasheet-158292269.pdf?src-supplier=Same+Sky; ComponentLink5Description: https://datasheet.octopart.com:443/TS09-63-25-R-260-SMT-TR-CUI-Devices-datasheet-158292269.pdf?src-supplier=Same+Sky; ComponentLink6URL: https://datasheet.octopart.com:443/TS09-63-25-R-260-SMT-TR-Same-Sky-datasheet-182881598.pdf?src-supplier=Electro+Sonic; ComponentLink6Description: https://datasheet.octopart.com:443/TS09-63-25-R-260-SMT-TR-Same-Sky-datasheet-182881598.pdf?src-supplier=Electro+Sonic; ComponentLink7URL: https://datasheet.octopart.com:443/TS09-63-25-R-260-SMT-TR-Same-Sky-datasheet-192884245.pdf?src-supplier=Farnell; ComponentLink7Description: https://datasheet.octopart.com:443/TS09-63-25-R-260-SMT-TR-Same-Sky-datasheet-192884245.pdf?src-supplier=Farnell; ComponentLink8URL: https://datasheet.octopart.com:443/TS09-63-25-R-260-SMT-TR-Same-Sky-datasheet-189105770.pdf?src-supplier=Master+Electronics; ComponentLink8Description: https://datasheet.octopart.com:443/TS09-63-25-R-260-SMT-TR-Same-Sky-datasheet-189105770.pdf?src-supplier=Master+Electronics; ComponentLink9URL: https://datasheet.octopart.com:443/TS09-63-25-R-260-SMT-TR-Same-Sky-datasheet-188930964.pdf?src-supplier=TME; ComponentLink9Description: https://datasheet.octopart.com:443/TS09-63-25-R-260-SMT-TR-Same-Sky-datasheet-188930964.pdf?src-supplier=TME; ComponentLink10URL: https://datasheet.octopart.com:443/TS09-63-25-R-260-SMT-TR-Same-Sky-datasheet-182050347.pdf?src-supplier=Future+Electronics; ComponentLink10Description: https://datasheet.octopart.com:443/TS09-63-25-R-260-SMT-TR-Same-Sky-datasheet-182050347.pdf?src-supplier=Future+Electronics; ComponentLink11URL: https://datasheet.octopart.com:443/TS09-63-25-R-260-SMT-TR-CUI-Devices-datasheet-179174346.pdf?src-supplier=Future+Electronics; ComponentLink11Description: https://datasheet.octopart.com:443/TS09-63-25-R-260-SMT-TR-CUI-Devices-datasheet-179174346.pdf?src-supplier=Future+Electronics; ComponentLink12URL: https://octopart.com:443/opatz8j6/c1?t=l5HlbAYCEQtF25ga8BP1gKdVmFC0QXFg10N-UqLcPEsKPWDSl4EieRPazQX1yw6b8O0XBlOCPwYRqM5QaactZwIDU8WDkrRHG3ALGquE8uURb9MJYj78InS78poluGHgaRJ6n1OuQuRgI3MH-qrDfFyez_fn7CRERxFORHNdKzTscx6YKaYx_RQSk_FV-_-LYVHzXEW8jfvtQZiY_Hf5lHgr3f3R8ssyKS9ab5UTeMAGmgVQvSGwnksim3FNXZXzl4A8l0AZEtRBwAgeRsI4I_QGMR1fI4MZmrQOhs7DigFNOXTzGq62qLa5zFbmCWSM0NT6wukQghT5URyGtJ59RmfDIq-vHVG0xFcwWCSYKzkPvFc-stx5Bfw&src-supplier=Compliance+Statements; ComponentLink12Description: https://octopart.com:443/opatz8j6/c1?t=l5HlbAYCEQtF25ga8BP1gKdVmFC0QXFg10N-UqLcPEsKPWDSl4EieRPazQX1yw6b8O0XBlOCPwYRqM5QaactZwIDU8WDkrRHG3ALGquE8uURb9MJYj78InS78poluGHgaRJ6n1OuQuRgI3MH-qrDfFyez_fn7CRERxFORHNdKzTscx6YKaYx_RQSk_FV-_-LYVHzXEW8jfvtQZiY_Hf5lHgr3f3R8ssyKS9ab5UTeMAGmgVQvSGwnksim3FNXZXzl4A8l0AZEtRBwAgeRsI4I_QGMR1fI4MZmrQOhs7DigFNOXTzGq62qLa5zFbmCWSM0NT6wukQghT5URyGtJ59RmfDIq-vHVG0xFcwWCSYKzkPvFc-stx5Bfw&src-supplier=Compliance+Statements; ComponentLink13URL: https://octopart.com:443/opatz8j6/c1?t=rnD4_cmvS0GvDkqEorAB0IvbTgunqYbFLvamlY5cC4WEmfAPsr-QNWzO_xtTcKtm-lvE8u6czRapqP8DvjaIpdzzgp7uGIJ-gJR9jPOz5U__OLSgYBAufGrJOvvjiVL20dlblNKD3BhQKY7Tacy-yaJgHXVccNkT7rOFzpIgKRqDyKEa2XXX206_6EtCsGcOW8v-ZrqSTPeLchu8Gi_oYKcbSywdws4DUthJGy8EV6pP5uGz9FA7L8jqPC6xCKMkIXlRFL4QD48j0J2jaWhrSlp5t4NIBeWh_XCtfam1rTv_vABtRQw2KWcl4GAajSUDiZMMIaW5kxzNEJAGXwejHH2rFvm5b8RK4A&src-supplier=Compliance+Statements; ComponentLink13Description: https://octopart.com:443/opatz8j6/c1?t=rnD4_cmvS0GvDkqEorAB0IvbTgunqYbFLvamlY5cC4WEmfAPsr-QNWzO_xtTcKtm-lvE8u6czRapqP8DvjaIpdzzgp7uGIJ-gJR9jPOz5U__OLSgYBAufGrJOvvjiVL20dlblNKD3BhQKY7Tacy-yaJgHXVccNkT7rOFzpIgKRqDyKEa2XXX206_6EtCsGcOW8v-ZrqSTPeLchu8Gi_oYKcbSywdws4DUthJGy8EV6pP5uGz9FA7L8jqPC6xCKMkIXlRFL4QD48j0J2jaWhrSlp5t4NIBeWh_XCtfam1rTv_vABtRQw2KWcl4GAajSUDiZMMIaW5kxzNEJAGXwejHH2rFvm5b8RK4A&src-supplier=Compliance+Statements; ComponentLink14URL: https://octopart.com:443/opatz8j6/c1?t=TI3mAHACpiCnRnVMXlWibSSZcbOEv1YzKZpOOd5d5zT4foCausP-AZNSr4D2W9wfJ_Vrh0_6kA448uPqHWYwX6LX_CWy0A0SO7Z05sF4OJA-fYsowgEvcH9E5UN-IB9qFZs3pj4UYLBCf79WijIzH1rdkw6OQv2g2oxaRK5uH7szxb3M-sSColjFJ5C6mmYlMDcqalGgkhrzFizAZvO01TtHDS8OZ9zi0WWfmjmN2-FhhCgbsMV7ZpOHWn4rafiEAygastn4JSSQw1s3wFoOKclMXLLFjCEDiSE0cOD76gKihggacBabcjWAJq9czjMLzF3U6KMdpYsn4LCFu_oQiW4rGw_o2RZjKSZrId0Nva6DVG-Bwg&src-supplier=Compliance+Statements; ComponentLink14Description: https://octopart.com:443/opatz8j6/c1?t=TI3mAHACpiCnRnVMXlWibSSZcbOEv1YzKZpOOd5d5zT4foCausP-AZNSr4D2W9wfJ_Vrh0_6kA448uPqHWYwX6LX_CWy0A0SO7Z05sF4OJA-fYsowgEvcH9E5UN-IB9qFZs3pj4UYLBCf79WijIzH1rdkw6OQv2g2oxaRK5uH7szxb3M-sSColjFJ5C6mmYlMDcqalGgkhrzFizAZvO01TtHDS8OZ9zi0WWfmjmN2-FhhCgbsMV7ZpOHWn4rafiEAygastn4JSSQw1s3wFoOKclMXLLFjCEDiSE0cOD76gKihggacBabcjWAJq9czjMLzF3U6KMdpYsn4LCFu_oQiW4rGw_o2RZjKSZrId0Nva6DVG-Bwg&src-supplier=Compliance+Statements; ComponentLink15URL: https://octopart.com:443/opatz8j6/c1?t=IBSzpZWkPKjoTxxsJHTHnLtZn-II44SZNwWU04FP6zjz3lxTCp1ixRG5BRyiD4nrT2U-U3GIHQ_eylyZWzqZQ3mC09DGK1Ff192yrmZ3BF8_k7yMxhJSezNDqSmtkR_toNPc6AiJZRvmax3emfVKYJoxO6NgxYK_ZtdrlOKX7ZdeDnPqL3eKqWG7OJdK8EtDv9_Am6WyAxiwOcci6Zp5QUxMbDC0pkHvnduhhqKdmCi4TP-MTG7eYW_MB0E4Os32YstEV2qk9BYq6dEO-MOry_RpVpNbPJcy9T7j8QSAJQD5qYRDzhJIpQG2Pk6U9hMOcU_qOBPjBkplPFEdTu8jRif0VYbMJWwWYKgVWIkXrjdK_O6E9gO8mpY&src-supplier=Compliance+Statements; ComponentLink15Description: https://octopart.com:443/opatz8j6/c1?t=IBSzpZWkPKjoTxxsJHTHnLtZn-II44SZNwWU04FP6zjz3lxTCp1ixRG5BRyiD4nrT2U-U3GIHQ_eylyZWzqZQ3mC09DGK1Ff192yrmZ3BF8_k7yMxhJSezNDqSmtkR_toNPc6AiJZRvmax3emfVKYJoxO6NgxYK_ZtdrlOKX7ZdeDnPqL3eKqWG7OJdK8EtDv9_Am6WyAxiwOcci6Zp5QUxMbDC0pkHvnduhhqKdmCi4TP-MTG7eYW_MB0E4Os32YstEV2qk9BYq6dEO-MOry_RpVpNbPJcy9T7j8QSAJQD5qYRDzhJIpQG2Pk6U9hMOcU_qOBPjBkplPFEdTu8jRif0VYbMJWwWYKgVWIkXrjdK_O6E9gO8mpY&src-supplier=Compliance+Statements; ComponentLink16URL: https://octopart.com:443/opatz8j6/c1?t=l533QolsdIF2NmxdgUpZdTG5LLY13_PFf5K5Q9rRz-bxmuWr6CaTVWFwix7oSYXEhYZ8HR0mejQkym4s3uB1uxKtOpFiPI18lsZaHyGRU6GjKl9SFsaU8BJ9V0YU2hAQaYVcmae5RRK05WYVdsDe17jV6JgcV75tYLCJqAtRxzJzNMrADyZU6Y5sC5E_PSj3oR64XZrAbn4jakqeEPyOGV1C17YvXZM4TdaFevu1BpatZJ7Rrd1fFVqoi_QDMqsmRjdUdK4Cj0-XzcDCWPHKyxXp-eKjH1HCadDpZQAg_RtB_K83KES51I0mAmAhd5fDKePdbdHCJ42cxZYZGPMPR1DELS0ZmSICUw&src-supplier=Compliance+Statements; ComponentLink16Description: https://octopart.com:443/opatz8j6/c1?t=l533QolsdIF2NmxdgUpZdTG5LLY13_PFf5K5Q9rRz-bxmuWr6CaTVWFwix7oSYXEhYZ8HR0mejQkym4s3uB1uxKtOpFiPI18lsZaHyGRU6GjKl9SFsaU8BJ9V0YU2hAQaYVcmae5RRK05WYVdsDe17jV6JgcV75tYLCJqAtRxzJzNMrADyZU6Y5sC5E_PSj3oR64XZrAbn4jakqeEPyOGV1C17YvXZM4TdaFevu1BpatZJ7Rrd1fFVqoi_QDMqsmRjdUdK4Cj0-XzcDCWPHKyxXp-eKjH1HCadDpZQAg_RtB_K83KES51I0mAmAhd5fDKePdbdHCJ42cxZYZGPMPR1DELS0ZmSICUw&src-supplier=Compliance+Statements; ComponentLink17URL: https://octopart.com:443/opatz8j6/c1?t=XS_8Dr14jAIkgmXGIz0DL9QAiXbM7D3AEBh1HjIbDuAlGp-qlN_3ZbfTR2DIGtOoGKG5QtQibMEp5_0zTpv15rq1BzK3Y184xIexRMqXUalu3pTO5IPcGoZd-s2kxnbqTz7sEnIYOJXoVv40fUph3RssNy5pgGwKs2eW3Ia8Kt5WnYIL_dqSKcOovwTbIBHNe3ztxlG08kEOD0r36ewwGRWUJvoxFk9kkvkmeONEwDYTuNacJ1GtPs9n2rPNdVMVbD_hJWJC_v5s-STKzt9lg-3zA3Zp03tom2sit_Nw6BKp4J91mM02HKe2Ot_-drUtePNF0VHYhuJ_7czTqW6UJC3YLBnzvWFLwy3_eTQs6ORaR8tihA&src-supplier=Compliance+Statements; ComponentLink17Description: https://octopart.com:443/opatz8j6/c1?t=XS_8Dr14jAIkgmXGIz0DL9QAiXbM7D3AEBh1HjIbDuAlGp-qlN_3ZbfTR2DIGtOoGKG5QtQibMEp5_0zTpv15rq1BzK3Y184xIexRMqXUalu3pTO5IPcGoZd-s2kxnbqTz7sEnIYOJXoVv40fUph3RssNy5pgGwKs2eW3Ia8Kt5WnYIL_dqSKcOovwTbIBHNe3ztxlG08kEOD0r36ewwGRWUJvoxFk9kkvkmeONEwDYTuNacJ1GtPs9n2rPNdVMVbD_hJWJC_v5s-STKzt9lg-3zA3Zp03tom2sit_Nw6BKp4J91mM02HKe2Ot_-drUtePNF0VHYhuJ_7czTqW6UJC3YLBnzvWFLwy3_eTQs6ORaR8tihA&src-supplier=Compliance+Statements; Supplier Part Number 1: 2223-TS09-63-25-R-260-SMT-TRCT-ND
U1 = IC_STM32F373CCT6: MCU, 32BIT, CORTEX-M4F, 72MHZ, LQFP-48; Manufacturer: STMicroelectronics; RAM Size: 32KB; Max Supply Voltage: 3.6V; Number of USB Channels: 1; Max Power Dissipation: 364mW; Interface: I2C,SPI,USB,CAN,IrDA,UART,USART,LIN,I2S; Number of I/Os: 36; Number of Timers/Counters: 14; Min Supply Voltage: 2V; Data Bus Width: 32b; Oscillator Type: Internal; Number of SPI Channels: 3; Number of I2C Channels: 2; Watchdog Timer: Yes; Memory Type: FLASH; Memory Size: 256KB; Peripherals: POR,PWM,WDT,DMA,I2C; Core Architecture: ARM; Supplier 1: Digi-Key; Manufacturer Part Number: STM32F373CCT6; Stock 1: 787; Pricing 1: 1=5.75, 10=5.162, 100=4.2296, 500=3.6005, 1000=3.0366 (USD); Case/Package: LQFP; Number of Pins: 48; Weight: 0.006409oz; Contact Plating: Gold; Min Operating Temperature: -40°C; Max Operating Temperature: 85°C; Packaging: Tray; Package Quantity: 250; Frequency: 72MHz; Max Frequency: 72MHz; Number of Programmable I/O: 36; Length: 7.2mm; Height: 1.45mm; Width: 7.2mm; Radiation Hardening: No; REACH SVHC: No SVHC; Lead Free: Lead Free; ComponentLink1URL: http://www.farnell.com/datasheets/1809253.pdf?src-supplier=Element14; ComponentLink1Description: http://www.farnell.com/datasheets/1809253.pdf?src-supplier=Element14; ComponentLink2URL: http://www.st.com/web/en/resource/technical/document/datasheet/DM00046749.pdf?src-supplier=Future+Electronics; ComponentLink2Description: http://www.st.com/web/en/resource/technical/document/datasheet/DM00046749.pdf?src-supplier=Future+Electronics; ComponentLink3URL: http://www.produktinfo.conrad.com/datenblaetter/1000000-1099999/001075619-da-01-en-MCU_32BT_256KB_STM32F373CCT6_LQFP_48_STM.pdf?src-supplier=Conrad; ComponentLink3Description: http://www.produktinfo.conrad.com/datenblaetter/1000000-1099999/001075619-da-01-en-MCU_32BT_256KB_STM32F373CCT6_LQFP_48_STM.pdf?src-supplier=Conrad; Supplier Part Number 1: 497-13251-ND
U2 = AP2112K-3.3TRG1: AP2112 Series 0.6 A 3.3 V Fixed Output SMT LDO Linear Regulator - SOT23-5; Manufacturer 1: Diodes Inc.; Accuracy: 1.5%; Dropout Voltage: 250mV; Max Input Voltage: 6V; Max Junction Temperature (Tj): 85°C; Max Output Current: 600mA; Min Input Voltage: 2.5V; Nominal Supply Current: 55µA; Number of Channels: 1; Output Voltage: 3.3V; Polarity: Positive; Supplier 1: DigiKey; Manufacturer Part Number 1: AP2112K-3.3TRG1; Stock 1: 32841; Pricing 1: 1=0,22, 10=0,153, 25=0,1348, 100=0,1151, 250=0,10576, 500=0,1001, 1000=0,09545 (USD); RoHS: Compliant; Ambient Temperature Range High: 85°C; Case/Package: SOT-23-5; China RoHS: Compliant; Height: 1.4mm; Height - Seated (Max): 1.45mm; Lead Free: Lead Free; Length: 2.92mm; Lifecycle Status: Production; Max Operating Temperature: 85°C; Max Supply Voltage: 6V; Min Operating Temperature: -40°C; Min Supply Voltage: 2.5V; Mount: Surface Mount; Number of Circuits: 1; Number of Outputs: 1; Number of Pins: 5; Number of Regulators: 1; Number of Terminals: 5; Output Current: 600mA; Output Type: Fixed; Packaging: Digi-Reel®; Quiescent Current: 55µA; REACH SVHC: Yes; Schedule B: 8542390000, 8542390000|8542390000|8542390000|8542390000|8542390000; Terminal Pitch: 950µm; Voltage Tolerance: 1.5%; Width: 1.6mm; ComponentLink1URL: https://datasheet.octopart.com:443/AP2112K-3.3TRG1-Diodes-Inc.-datasheet-101745658.pdf?src-supplier=IHS; ComponentLink1Description: https://datasheet.octopart.com:443/AP2112K-3.3TRG1-Diodes-Inc.-datasheet-101745658.pdf?src-supplier=IHS; ComponentLink2URL: https://datasheet.octopart.com:443/AP2112K-3.3TRG1-Diodes-Inc.-datasheet-182385097.pdf?src-supplier=IHS; ComponentLink2Description: https://datasheet.octopart.com:443/AP2112K-3.3TRG1-Diodes-Inc.-datasheet-182385097.pdf?src-supplier=IHS; ComponentLink3URL: https://datasheet.octopart.com:443/AP2112K-3.3TRG1-Diodes-Inc.-datasheet-37177583.pdf?src-supplier=SHENGYU+ELECTRONICS; ComponentLink3Description: https://datasheet.octopart.com:443/AP2112K-3.3TRG1-Diodes-Inc.-datasheet-37177583.pdf?src-supplier=SHENGYU+ELECTRONICS; ComponentLink4URL: https://sigma.octopart.com:443/138895853/technical_drawing/Diodes-Inc.-AP2112K-3.3TRG1.pdf?src-supplier=Upverter; ComponentLink4Description: https://sigma.octopart.com:443/138895853/technical_drawing/Diodes-Inc.-AP2112K-3.3TRG1.pdf?src-supplier=Upverter; Supplier Part Number 1: AP2112K-3.3TRG1DICT-ND